# Altium project MAX51.PrjPCB
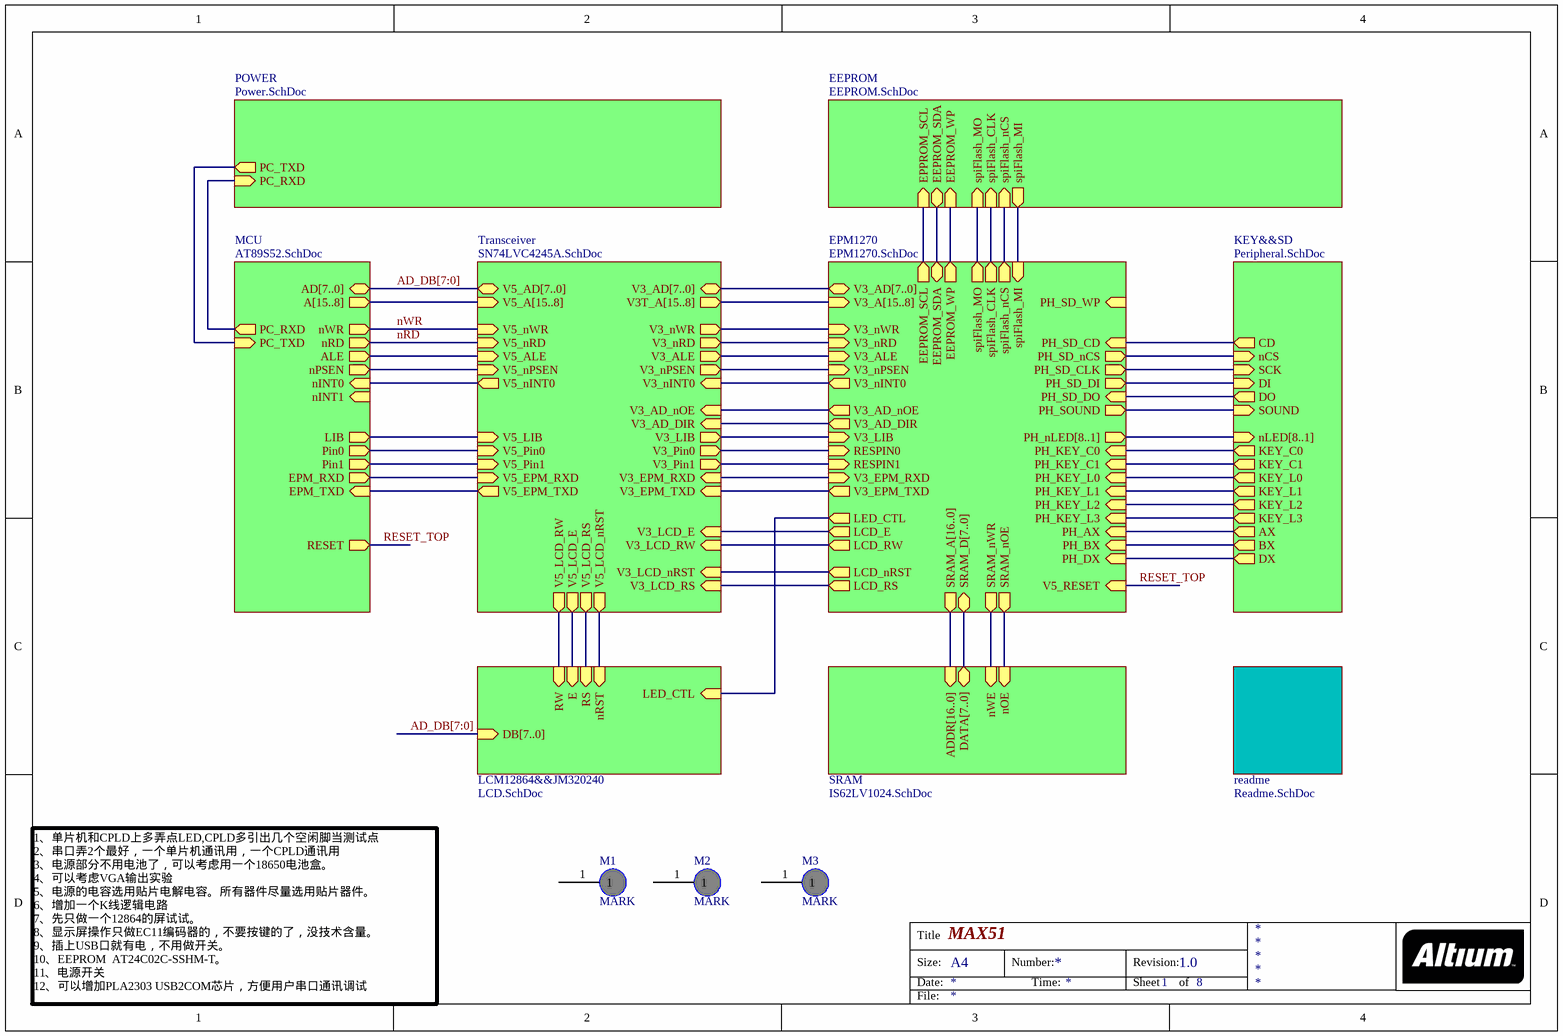
[diagram p0: Top.SchDoc]
8 sheets, 147 parts. Net scope: hierarchical (ports join the sheet entries above them; power ports are global).
Board file: MAX51.PcbDoc
Sheets:
  Top.SchDoc
    POWER = Power.SchDoc
    MCU = AT89S52.SchDoc
    EPM1270 = EPM1270.SchDoc
    KEY&&SD = Peripheral.SchDoc
    LCM12864&&JM320240 = LCD.SchDoc
    SRAM = IS62LV1024.SchDoc
    readme = Readme.SchDoc

## Sheet Top.SchDoc: MAX51
size A4; CompanyName: 北京一雄信息科技有限公司; DrawnBy: JIAWENWEI; Revision: 1.0; SheetNumber: 1; SheetTotal: 8

### Parts
M1  MARK  [MARK3MM]
M2  MARK  [MARK3MM]
M3  MARK  [MARK3MM]

### Sub-sheets
EEPROM = EEPROM.SchDoc (file not in this document): EEPROM_SDA (bidir), EPPROM_SCL (in), EEPROM_WP (in), spiFlash_MO (in), spiFlash_CLK (in), spiFlash_nCS (in), spiFlash_MI (out)
EPM1270 = EPM1270.SchDoc: V3_LIB (in), V3_nPSEN (in), V3_nRD (in), V3_nWR (in), V3_ALE (in), V3_nINT0 (out), SRAM_nOE (out), SRAM_nWR (out), LCD_RS (out), LCD_nRST (out), LED_CTL (out), V3_AD_nOE (out), V3_AD_DIR (out), PH_SD_CD (in), PH_SD_WP (in), PH_SD_nCS (out), PH_SD_CLK (out), PH_SD_DI (out), PH_SD_DO (in), PH_SOUND (out), PH_KEY_C0 (in), PH_KEY_C1 (in), PH_KEY_L0 (in), PH_KEY_L1 (in), PH_KEY_L2 (in), PH_AX (in), PH_BX (in), PH_DX (in), V3_AD[7..0] (bidir), SRAM_A[16..0] (out), SRAM_D[7..0] (bidir), V3_A[15..8] (in), PH_nLED[8..1] (out), LCD_E (out), LCD_RW (out), V3_EPM_TXD (out), V3_EPM_RXD (in), RESPIN0 (in), RESPIN1 (in), V5_RESET (in), EEPROM_SDA (bidir), EEPROM_SCL (out), EEPROM_WP (out), spiFlash_MO (out), spiFlash_MI (in), spiFlash_CLK (out), spiFlash_nCS (out), PH_KEY_L3 (in)
KEY&&SD = Peripheral.SchDoc: KEY_C0 (out), KEY_C1 (out), KEY_L0 (out), KEY_L1 (out), KEY_L2 (out), SOUND (in), DI (in), SCK (in), DO (out), CD (out), AX (out), BX (out), DX (out), nCS (in), nLED[8..1] (in), KEY_L3 (out)
LCM12864&&JM320240 = LCD.SchDoc: RS (in), LED_CTL (in), nRST (in), DB[7..0] (in), RW (in), E (in)
MCU = AT89S52.SchDoc: nWR (out), nRD (out), ALE (out), nPSEN (out), nINT0 (in), LIB (out), AD[7..0] (bidir), A[15..8] (out), EPM_TXD (in), EPM_RXD (out), Pin0 (out), Pin1 (out), PC_RXD (out), PC_TXD (in), nINT1 (in), RESET (out)
POWER = Power.SchDoc: PC_TXD (out), PC_RXD (in)
readme = Readme.SchDoc: no entries
SRAM = IS62LV1024.SchDoc: nWE (in), nOE (in), ADDR[16..0] (in), DATA[7..0] (bidir)
Transceiver = SN74LVC4245A.SchDoc (file not in this document): V3_LCD_RS (in), V3_LCD_nRST (in), V5_LCD_RS (out), V5_LCD_nRST (out), V3_AD_DIR (in), V3_AD_nOE (in), V3_nINT0 (in), V5_LIB (in), V5_nPSEN (in), V5_nRD (in), V5_nWR (in), V5_ALE (in), V3_LIB (out), V3_nPSEN (out), V3_nRD (out), V3_nWR (out), V3_ALE (out), V5_nINT0 (out), V5_AD[7..0] (bidir), V3_AD[7..0] (bidir), V5_A[15..8] (in), V3T_A[15..8] (out), V3_LCD_RW (in), V3_LCD_E (in), V5_LCD_RW (out), V5_LCD_E (out), V5_Pin0 (in), V3_Pin0 (out), V5_EPM_TXD (out), V3_EPM_TXD (in), V3_Pin1 (out), V5_Pin1 (in), V5_EPM_RXD (in), V3_EPM_RXD (in)

### Nets
~{CS}: sheet EPM1270/PH_SD_nCS, sheet KEY&&SD/nCS
ALE: sheet MCU/ALE, sheet Transceiver/V5_ALE
AX: sheet EPM1270/PH_AX, sheet KEY&&SD/AX
BX: sheet EPM1270/PH_BX, sheet KEY&&SD/BX
CD: sheet EPM1270/PH_SD_CD, sheet KEY&&SD/CD
DI: sheet EPM1270/PH_SD_DI, sheet KEY&&SD/DI
DO: sheet EPM1270/PH_SD_DO, sheet KEY&&SD/DO
DX: sheet EPM1270/PH_DX, sheet KEY&&SD/DX
E: sheet LCM12864&&JM320240/E, sheet Transceiver/V5_LCD_E
EPM_RXD: sheet MCU/EPM_RXD, sheet Transceiver/V5_EPM_RXD
EPM_TXD: sheet MCU/EPM_TXD, sheet Transceiver/V5_EPM_TXD
KEY_C0: sheet EPM1270/PH_KEY_C0, sheet KEY&&SD/KEY_C0
KEY_C1: sheet EPM1270/PH_KEY_C1, sheet KEY&&SD/KEY_C1
KEY_L0: sheet EPM1270/PH_KEY_L0, sheet KEY&&SD/KEY_L0
KEY_L1: sheet EPM1270/PH_KEY_L1, sheet KEY&&SD/KEY_L1
KEY_L2: sheet EPM1270/PH_KEY_L2, sheet KEY&&SD/KEY_L2
KEY_L3: sheet EPM1270/PH_KEY_L3, sheet KEY&&SD/KEY_L3
LCD_E: sheet EPM1270/LCD_E, sheet Transceiver/V3_LCD_E
LCD_nRST: sheet EPM1270/LCD_nRST, sheet Transceiver/V3_LCD_nRST
LCD_RS: sheet EPM1270/LCD_RS, sheet Transceiver/V3_LCD_RS
LCD_RW: sheet EPM1270/LCD_RW, sheet Transceiver/V3_LCD_RW
LED_CTL: sheet EPM1270/LED_CTL, sheet LCM12864&&JM320240/LED_CTL
LIB: sheet MCU/LIB, sheet Transceiver/V5_LIB
nINT0: sheet MCU/nINT0, sheet Transceiver/V5_nINT0
nOE: sheet EPM1270/SRAM_nOE, sheet SRAM/nOE
nPSEN: sheet MCU/nPSEN, sheet Transceiver/V5_nPSEN
nRD: sheet MCU/nRD, sheet Transceiver/V5_nRD
nRST: sheet LCM12864&&JM320240/nRST, sheet Transceiver/V5_LCD_nRST
nWE: sheet EPM1270/SRAM_nWR, sheet SRAM/nWE
nWR: sheet MCU/nWR, sheet Transceiver/V5_nWR
PC_RXD: sheet POWER/PC_RXD, sheet MCU/PC_RXD
PC_TXD: sheet POWER/PC_TXD, sheet MCU/PC_TXD
PH_SD_CLK: sheet EPM1270/PH_SD_CLK, sheet KEY&&SD/SCK
PH_SOUND: sheet EPM1270/PH_SOUND, sheet KEY&&SD/SOUND
Pin0: sheet MCU/Pin0, sheet Transceiver/V5_Pin0
Pin1: sheet MCU/Pin1, sheet Transceiver/V5_Pin1
RESET_TOP: sheet MCU/RESET, sheet EPM1270/V5_RESET  [project net RESET]
ResPin0: sheet EPM1270/RESPIN0, sheet Transceiver/V3_Pin0
ResPin1: sheet EPM1270/RESPIN1, sheet Transceiver/V3_Pin1
RS: sheet LCM12864&&JM320240/RS, sheet Transceiver/V5_LCD_RS
RW: sheet LCM12864&&JM320240/RW, sheet Transceiver/V5_LCD_RW
V3_ALE: sheet EPM1270/V3_ALE, sheet Transceiver/V3_ALE
V3_EPM_RXD: sheet EPM1270/V3_EPM_RXD, sheet Transceiver/V3_EPM_RXD
V3_EPM_TXD: sheet EPM1270/V3_EPM_TXD, sheet Transceiver/V3_EPM_TXD
V3_LIB: sheet EPM1270/V3_LIB, sheet Transceiver/V3_LIB
V3_nINT0: sheet EPM1270/V3_nINT0, sheet Transceiver/V3_nINT0
V3_nPSEN: sheet EPM1270/V3_nPSEN, sheet Transceiver/V3_nPSEN
V3_nRD: sheet EPM1270/V3_nRD, sheet Transceiver/V3_nRD
V3_nWR: sheet EPM1270/V3_nWR, sheet Transceiver/V3_nWR
NetU4_1: sheet EPM1270/V3_AD_DIR, sheet Transceiver/V3_AD_DIR
NetU4_2: sheet EPM1270/V3_AD_nOE, sheet Transceiver/V3_AD_nOE
NetU4_57: sheet EPM1270/EEPROM_SDA, sheet EEPROM/EEPROM_SDA
NetU4_58: sheet EPM1270/EEPROM_SCL, sheet EEPROM/EPPROM_SCL
NetU4_59: sheet EPM1270/EEPROM_WP, sheet EEPROM/EEPROM_WP
NetU4_66: sheet EPM1270/spiFlash_MO, sheet EEPROM/spiFlash_MO
NetU4_67: sheet EPM1270/spiFlash_CLK, sheet EEPROM/spiFlash_CLK
NetU4_68: sheet EPM1270/spiFlash_nCS, sheet EEPROM/spiFlash_nCS
NetU4_69: sheet EPM1270/spiFlash_MI, sheet EEPROM/spiFlash_MI

Not connected (* = marked no-connect by the designer): M1 1; M2 1; M3 1

### Buses and harness runs
bus AD_DB[7:0] = sheet LCM12864&&JM320240/DB[7..0]
bus AD_DB[7:0] = sheet MCU/AD[7..0] = sheet Transceiver/V5_AD[7..0]
bus sheet EPM1270/PH_nLED[8..1] = sheet KEY&&SD/nLED[8..1]
bus sheet EPM1270/SRAM_A[16..0] = sheet SRAM/ADDR[16..0]
bus sheet EPM1270/SRAM_D[7..0] = sheet SRAM/DATA[7..0]
bus sheet EPM1270/V3_A[15..8] = sheet Transceiver/V3T_A[15..8]
bus sheet EPM1270/V3_AD[7..0] = sheet Transceiver/V3_AD[7..0]
bus sheet MCU/A[15..8] = sheet Transceiver/V5_A[15..8]

### Notes on the sheet
- 1、单片机和CPLD上多弄点LED,CPLD多引出几个空闲脚当测试点
  2、串口弄2个最好，一个单片机通讯用，一个CPLD通讯用
  3、电源部分不用电池了，可以考虑用一个18650电池盒。
  4、可以考虑VGA输出实验
  5、电源的电容选用贴片电解电容。所有器件尽量选用贴片器件。
  6、增加一个K线逻辑电路
  7、先只做一个12864的屏试试。
  8、显示屏操作只做EC11编码器的，不要按键的了，没技术含量。
  9、插上USB口就有电，不用做开关。
  10、EEPROM  AT24C02C-SSHM-T。
  11、电源开关
  12、可以增加PLA2303 USB2COM芯片，方便用户串口通讯调试
- Title
- Size:
- Date:
- A4
- Number:
- Time:
- Revision:
- Sheet
- of
- File:

## Sheet Power.SchDoc
size A4; Organization: Altium Limited; Address1: L3, 12a Rodborough Rd; Address2: Frenchs Forest; Address3: NSW; Address4: Australia 2086; SheetNumber: 2; SheetTotal: 8
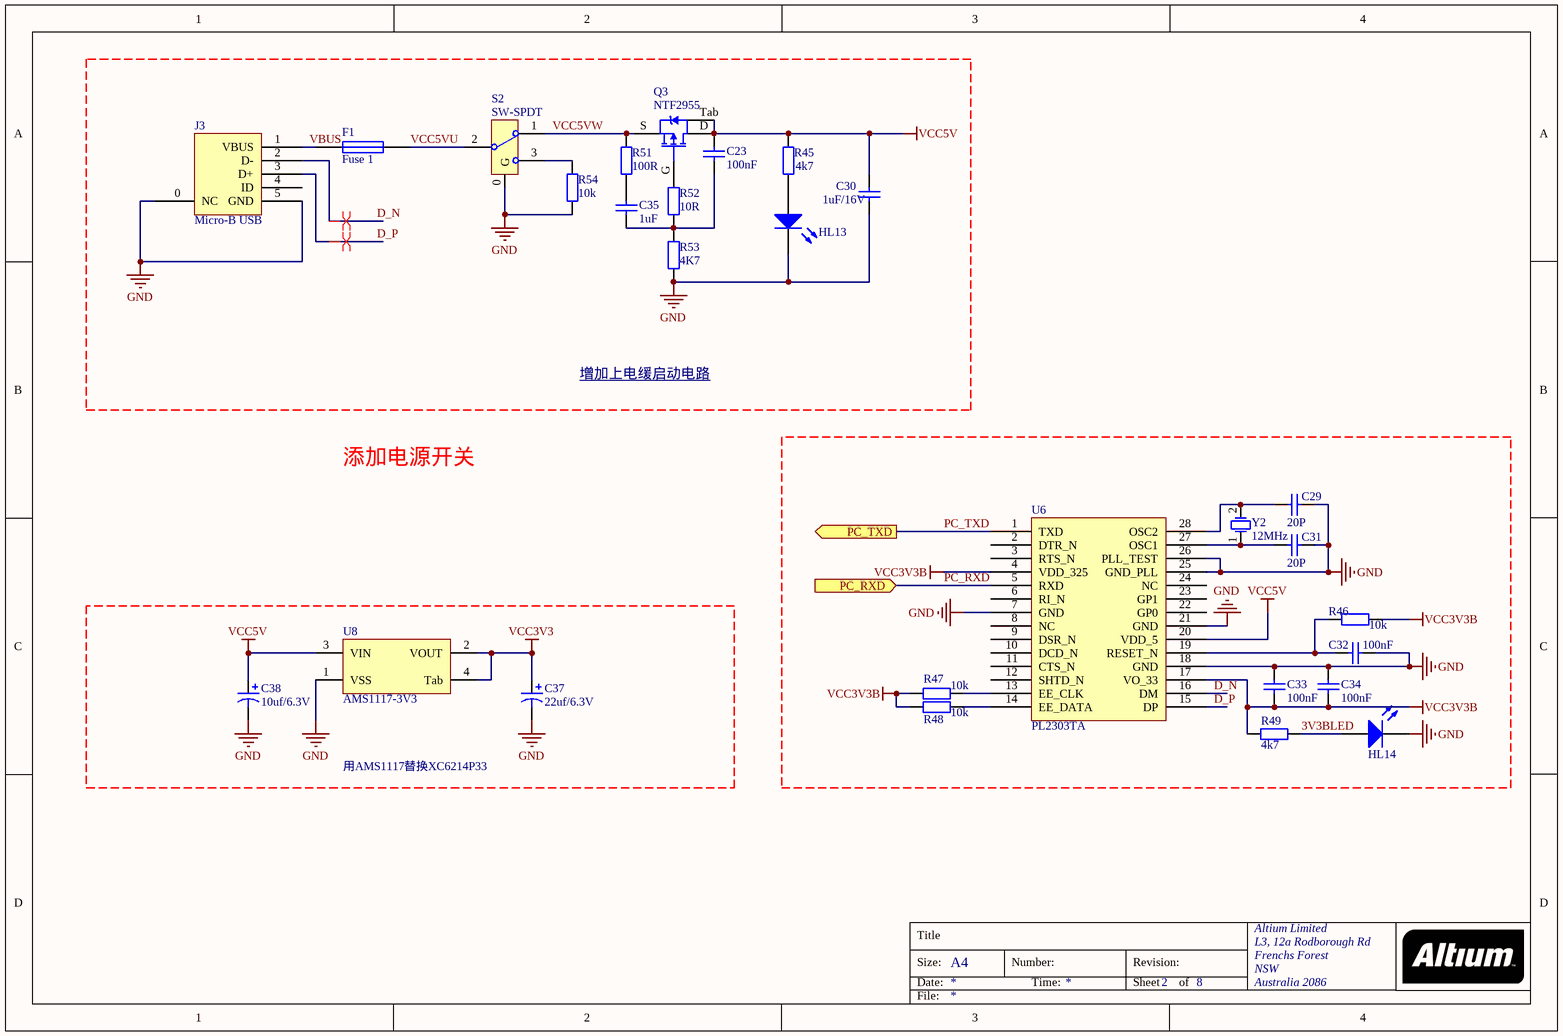
[diagram p1: Power.SchDoc]

### Parts
(Parts that share a designator on the sheet are numbered #1, #2 ... from top to bottom, then left to right.)
C23#1  100nF  [C0603]
C29  20P  [R0603]
C30  1uF/16V  [C0805]
C31  20P  [R0603]
C32  100nF  [R0603]
C33  100nF  [R0603]
C34  100nF  [C0805]
C35  1uF  [C0603]
C37  22uf/6.3V  [B-3528]
C38  10uf/6.3V  [B-3528]
F1  Fuse 1  [R0805]
HL13  LED  [LED_0603]  (value not drawn)
HL14  LED  [LED_0603]  (value not drawn)
J3  Micro-B USB  [Micro-B  USB1]
Q3  NTF2955  [NTF2955]
R45  4k7  [R0603]
R46  10k  [R0603]
R47  10k  [R0603]
R48  10k  [R0603]
R49  4k7  [R0603]
R51  100R  [R0603]
R52  10R  [R0603]
R53  4K7  [R0603]
R54  10k  [R0603]
S2  SW-SPDT  [SW_SPDT]
U6  PL2303TA  [SSOP28]
U8  AMS1117-3V3  [SOT-223]
Y2  12MHz  [XTAL]

### Ports
PC_RXD (in), PC_TXD (out)

### Nets
GND: C29.2 C30.1 C31.2 C32.1 C33.1 C34.1 C37.2 C38.2 HL13.K HL14.K J3.0(NC) J3.5(GND) R53.1 R54.1 S2.0(G) U6.7(GND) U6.18(GND) U6.21(GND) U6.25(GND_PLL) U6.26(PLL_TEST) U8.1(VSS)
VCC3V3: C37.1 U8.2(VOUT) U8.4(Tab)
VCC3V3B: C33.2 C34.2 R46.2 R47.1 R48.1 R49.1 U6.4(VDD_325) U6.17(VO_33)
VCC5V: C23#1.2 C30.2 C38.1 Q3.D Q3.Tab(D) R45.2 U6.20(VDD_5) U8.3(VIN)
3V3BLED: HL14.A R49.2
D_N: J3.2(D-) U6.16(DM)
D_P: J3.3(D+) U6.15(DP)
PC_RXD: U6.5(RXD) ; port PC_RXD
PC_TXD: U6.1(TXD) ; port PC_TXD
VBUS: F1.1 J3.1(VBUS)
VCC5VU: F1.2 S2.2(COMMON)
VCC5VW: Q3.S R51.2 S2.1(NO1)
NetC23#1_1: C23#1.1 C35.2 R52.1 R53.2
NetC29_1: C29.1 U6.28(OSC2) Y2.2(OSC2)
NetC31_1: C31.1 U6.27(OSC1) Y2.1(OSC1)
NetC32_2: C32.2 R46.1 U6.19(RESET_N)
NetC35_1: C35.1 R51.1
NetHL13_A: HL13.A R45.1
NetQ3_G: Q3.G R52.2
NetR47_2: R47.2 U6.13(EE_CLK)
NetR48_2: R48.2 U6.14(EE_DATA)
NetR54_2: R54.2 S2.3(NO3)

Not connected (* = marked no-connect by the designer): J3 4(ID); U6 2(DTR_N) 3(RTS_N) 6(RI_N) 8(NC) 9(DSR_N) 10(DCD_N) 11(CTS_N) 12(SHTD_N) 22(GP0) 23(GP1) 24(NC)

### Layout directives
differential pair: D_N, D_P

### Notes on the sheet
- 增加上电缓启动电路
- 添加电源开关
- 用AMS1117替换XC6214P33
- Title
- Size:
- Date:
- A4
- Number:
- Time:
- Revision:
- Sheet
- of
- File:

### Library data of the parts
C23#1 C30 C35 = CAP_08
C29 C31-C34 = CAP_06
C37 C38 = CAP_B
F1 = Fuse 1: Fuse; Published: 8-Jun-2000; LatestRevisionDate: 17-Jul-2002; LatestRevisionNote: Re-released for DXP Platform.; PackageReference: PIN-W2/E2.8; Publisher: Altium Limited; PackageDescription: Thru-Hole; 2 Leads
HL13 HL14 = LED 2
Q3 = NTF2955-3
R45-R49 R51-R54 = RES_06
S2 = SW-SPDT: Single-Pole, Duble Throw Switch; Published: 24-Mar-1999; LatestRevisionDate: 17-Jul-2002; LatestRevisionNote: Re-released for DXP Platform.; PackageReference: SPST-2; Publisher: Altium Limited; PackageDescription: Switch; 2 Leads
U8 = AMS1117
Y2 = XTAL: Passive crystal

## Sheet AT89S52.SchDoc
size A4; SheetNumber: 3; SheetTotal: 8
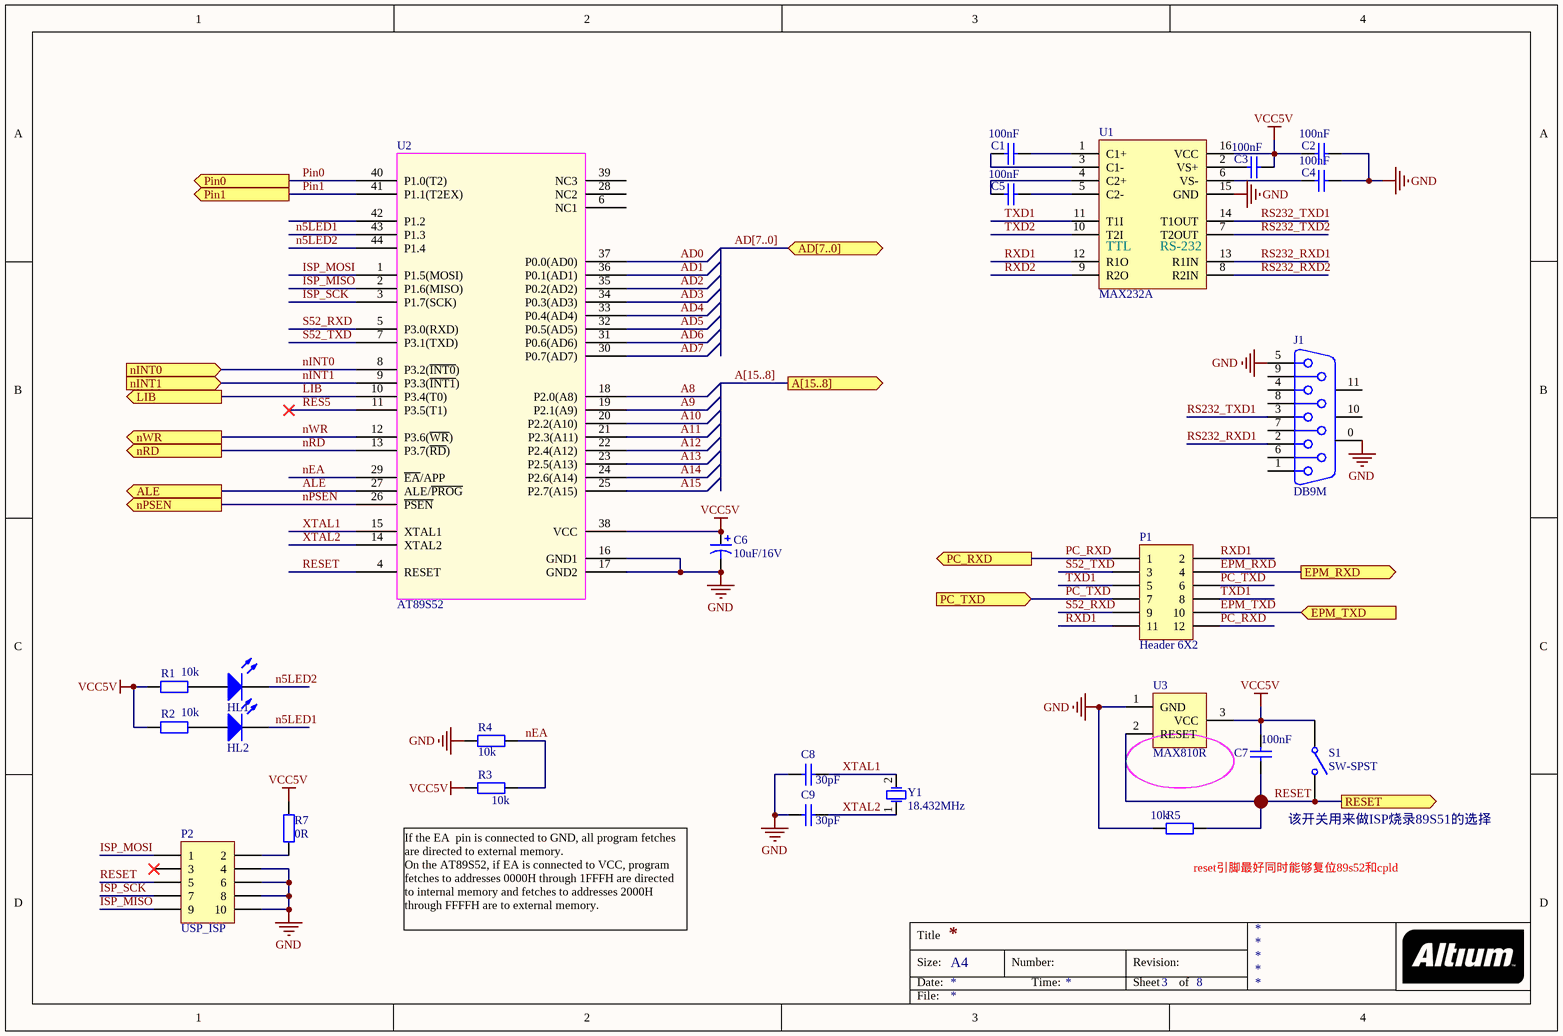
[diagram p2: AT89S52.SchDoc]

### Parts
(Parts that share a designator on the sheet are numbered #1, #2 ... from top to bottom, then left to right.)
C1  100nF  [R0603]
C2  100nF  [R0603]
C3  100nF  [R0603]
C4  100nF  [R0603]
C5  100nF  [R0603]
C6  10uF/16V  [C0805]
C7  100nF  [R0603]
C8  30pF  [R0603]
C9  30pF  [R0603]
HL1  LED  [LED_0603]  (value not drawn)
HL2  LED  [LED_0603]  (value not drawn)
J1  DB9M
P1  Header 6X2  [HDR2X6]
P2  USP_ISP  [HDR2X5]
R1  10k  [R0603]
R2  10k  [R0603]
R3  10k  [R0603]
R4  10k  [R0603]
R5  10k  [R0603]
R7#1  0R  [R0603]
S1  SW-SPST  [K1]
U1  MAX232A  [NSO16_M]
U2  AT89S52  [AT89S52-TQFP44]
U3  MAX810R  [MAX810R-SOT23]
Y1  18.432MHz  [XTAL]

### Ports
A[15..8] (out), AD[7..0] (bidir), ALE (out), EPM_RXD (out), EPM_TXD (in), LIB (out), nINT0 (in), nINT1 (in), nPSEN (out), nRD (out), nWR (out), PC_RXD (out), PC_TXD (in), Pin0 (out), Pin1 (out), RESET (out)

### Nets
GND: C2.1 C4.1 C6.2 C8.2 C9.2 J1.0 J1.5 P2.4 P2.6 P2.8 P2.10 R4.1 R5.1 U1.15(GND) U2.16(GND1) U2.17(GND2) U3.1(GND)
VCC5V: C2.2 C3.1 C6.1 C7.2 R1.2 R2.2 R3.2 R7#1.1 S1.1(COMMON) U1.16(VCC) U2.38(VCC) U3.3(VCC)
A8: U2.18(P2.0(A8))
A9: U2.19(P2.1(A9))
A10: U2.20(P2.2(A10))
A11: U2.21(P2.3(A11))
A12: U2.22(P2.4(A12))
A13: U2.23(P2.5(A13))
A14: U2.24(P2.6(A14))
A15: U2.25(P2.7(A15))
AD0: U2.37(P0.0(AD0))
AD1: U2.36(P0.1(AD1))
AD2: U2.35(P0.2(AD2))
AD3: U2.34(P0.3(AD3))
AD4: U2.33(P0.4(AD4))
AD5: U2.32(P0.5(AD5))
AD6: U2.31(P0.6(AD6))
AD7: U2.30(P0.7(AD7))
ALE: U2.27(ALE/~{PROG}) ; port ALE
EPM_RXD: P1.4 ; port EPM_RXD
EPM_TXD: P1.10 ; port EPM_TXD
ISP_MISO: P2.9 U2.2(P1.6(MISO))
ISP_MOSI: P2.1 U2.1(P1.5(MOSI))
ISP_SCK: P2.7 U2.3(P1.7(SCK))
LIB: U2.10(P3.4(T0)) ; port LIB
n5LED1: HL2.K U2.43(P1.3)
n5LED2: HL1.K U2.44(P1.4)
nEA: R3.1 R4.2 U2.29(~{EA}/APP)
nINT0: U2.8(P3.2(~{INT0})) ; port nINT0
nINT1: U2.9(P3.3(~{INT1})) ; port nINT1
nPSEN: U2.26(~{PSEN}) ; port nPSEN
nRD: U2.13(P3.7(~{RD})) ; port nRD
nWR: U2.12(P3.6(~{WR})) ; port nWR
PC_RXD: P1.1 P1.12 ; port PC_RXD
PC_TXD: P1.6 P1.7 ; port PC_TXD
Pin0: U2.40(P1.0(T2)) ; port Pin0
Pin1: U2.41(P1.1(T2EX)) ; port Pin1
RES5: U2.11(P3.5(T1))
RESET: C7.1 P2.5 R5.2 S1.2(NO) U2.4(RESET) U3.2(RESET) ; port RESET
RS232_RXD1: J1.2 U1.13(R1IN)
RS232_RXD2: U1.8(R2IN)
RS232_TXD1: J1.3 U1.14(T1OUT)
RS232_TXD2: U1.7(T2OUT)
RXD1: P1.2 P1.11 U1.12(R1O)
RXD2: U1.9(R2O)
S52_RXD: P1.9 U2.5(P3.0(RXD))
S52_TXD: P1.3 U2.7(P3.1(TXD))
TXD1: P1.5 P1.8 U1.11(T1I)
TXD2: U1.10(T2I)
XTAL1: C8.1 U2.15(XTAL1) Y1.2(OSC2)
XTAL2: C9.1 U2.14(XTAL2) Y1.1(OSC1)
NetC1_1: C1.1 U1.1(C1+)
NetC1_2: C1.2 U1.3(C1-)
NetC3_2: C3.2 U1.2(VS+)
NetC4_2: C4.2 U1.6(VS-)
NetC5_1: C5.1 U1.5(C2-)
NetC5_2: C5.2 U1.4(C2+)
NetHL1_A: HL1.A R1.1
NetHL2_A: HL2.A R2.1
NetP2_2: P2.2 R7#1.2

Not connected (* = marked no-connect by the designer): J1 1 4 6 7 8 9 10(MH1) 11(MH2); P2 3*; U2 6(NC1) 28(NC2) 39(NC3) 42(P1.2)

### Buses and harness runs
bus A[15..8] = port A[15..8]
bus AD[7..0] = port AD[7..0]

### Notes on the sheet
- 该开关用来做ISP烧录89S51的选择
- (near R3) If the EA  pin is connected to GND, all program fetches
  are directed to external memory.
  On the AT89S52, if EA is connected to VCC, program
  fetches to addresses 0000H through 1FFFH are directed
  to internal memory and fetches to addresses 2000H
  through FFFFH are to external memory.
- (near R5) reset引脚最好同时能够复位89s52和cpld
- Title
- Size:
- Date:
- A4
- Number:
- Time:
- Revision:
- Sheet
- of
- File:
- (in symbol MAX232A) TTL; RS-232

### Library data of the parts
C1-C5 C7 = CAP_04: Value: 100nF
C6 = CAP_A
C8 C9 = CAP_04: Value: 100nF
HL1 HL2 = LED 2
P1 = Header 6X2: Header, 6-Pin, Dual row; LatestRevisionDate: 17-Jul-2002; LatestRevisionNote: Re-released for DXP Platform.; Publisher: Altium Limited
P2 = Header 5X2: Header, 5-Pin, Dual row; LatestRevisionDate: 17-Jul-2002; LatestRevisionNote: Re-released for DXP Platform.; Publisher: Altium Limited
R1 R2 = RES_04: Value: 10K
R3 = RES_04: 0402R; Value: 10K
R4 R5 = RES_04: 0402; Value: 10K
R7#1 = RES_04: 0402R; Value: 10K
S1 = SW-SPST: Single-Pole, Single-Throw Switch; Published: 24-Mar-1999; LatestRevisionDate: 17-Jul-2002; LatestRevisionNote: Re-released for DXP Platform.; PackageReference: SPST-2; Publisher: Altium Limited; PackageDescription: Switch; 2 Leads
U1 = MAX232A: +5V-Powered, Multichannel RS-232 Drivers/Receivers
U2 = AT89S52-24U
Y1 = XTAL: Passive crystal

## Sheet EPM1270.SchDoc
size A4; Organization: Altium Limited; Address1: L3, 12a Rodborough Rd; Address2: Frenchs Forest; Address3: NSW; Address4: Australia 2086; SheetNumber: 4; SheetTotal: 8
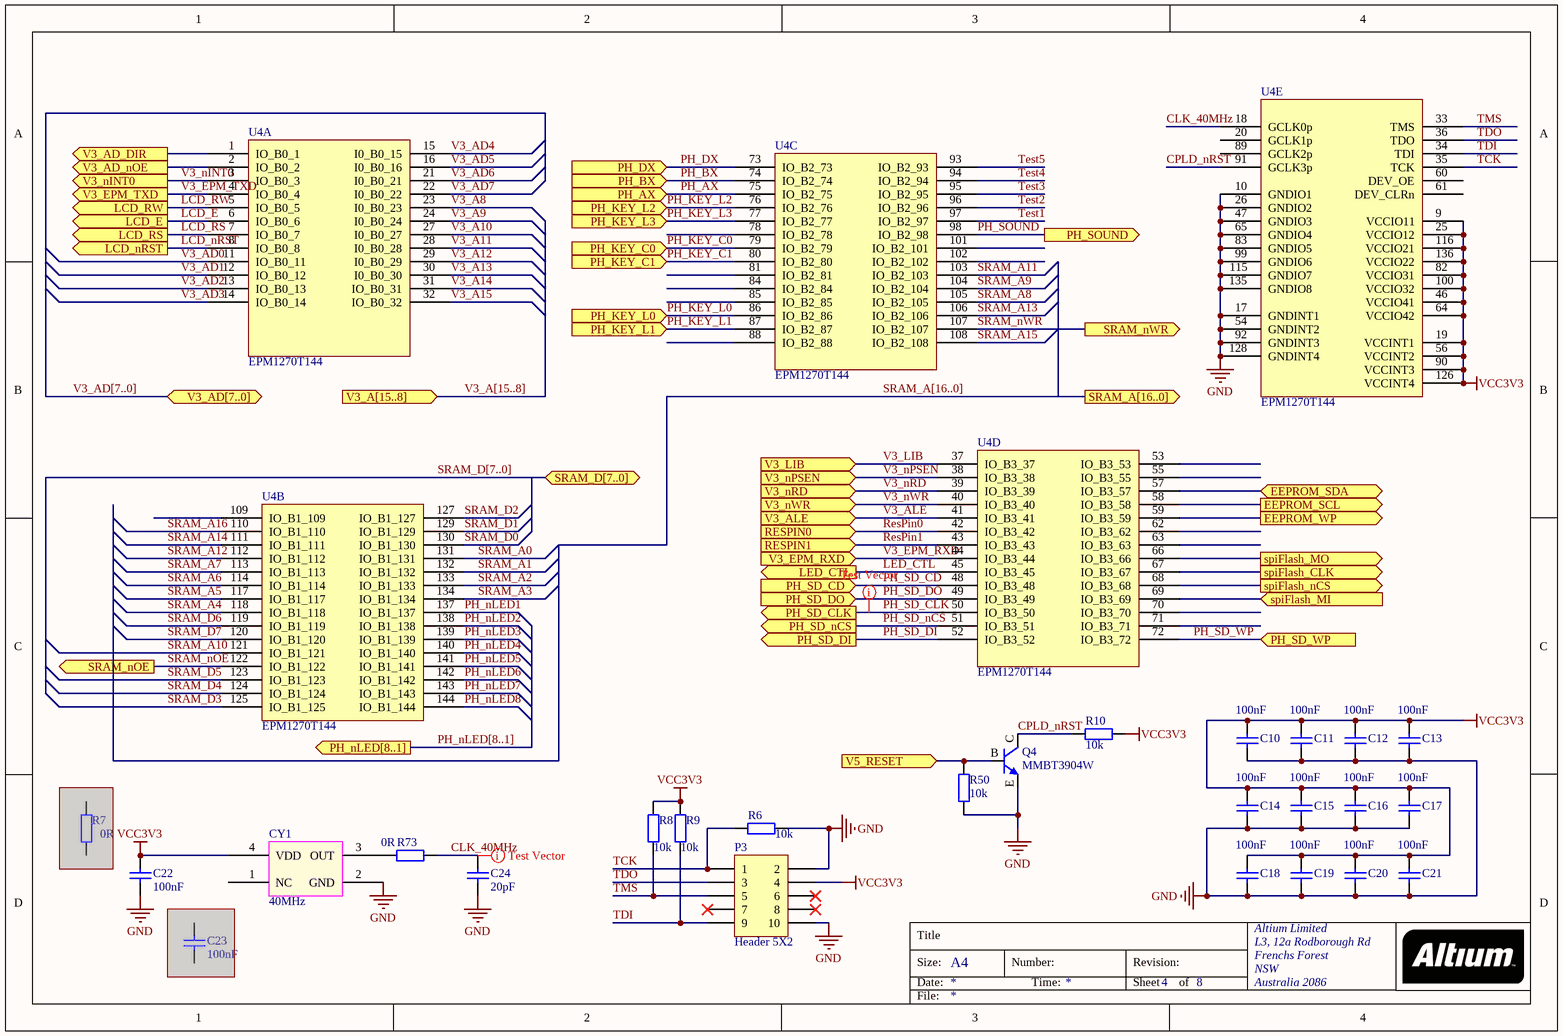
[diagram p3: EPM1270.SchDoc]

### Parts
(Parts that share a designator on the sheet are numbered #1, #2 ... from top to bottom, then left to right.)
C10  100nF  [R0603]
C11  100nF  [R0603]
C12  100nF  [R0603]
C13  100nF  [R0603]
C14  100nF  [R0603]
C15  100nF  [R0603]
C16  100nF  [R0603]
C17  100nF  [R0603]
C18  100nF  [R0603]
C19  100nF  [R0603]
C20  100nF  [R0603]
C21  100nF  [R0603]
C22  100nF  [R0603]
C23#2  100nF  [R0603]  (masked out: inside a compile mask, not in the netlist)
C24  value 20pF  [R0603]  (hidden comment: 100nF)
CY1  40MHz  [XCY4_5032]
P3  Header 5X2  [HDR2X5]
Q4  MMBT3904W  [SOT_23]
R6  10k  [R0603]
R7#2  0R  [R0603]  (masked out: inside a compile mask, not in the netlist)
R8  10k  [R0603]
R9  10k  [R0603]
R10  10k  [R0603]
R50  10k  [R0603]
R73  0R  [R0603]
U4  EPM1270T144  [EPM1270T144-TQFP]  (parts A,B,C,D,E of 5)

### Ports
EEPROM_SCL (out), EEPROM_SDA (bidir), EEPROM_WP (out), LCD_E (out), LCD_nRST (out), LCD_RS (out), LCD_RW (out), LED_CTL (out), PH_AX (in), PH_BX (in), PH_DX (in), PH_KEY_C0 (in), PH_KEY_C1 (in), PH_KEY_L0 (in), PH_KEY_L1 (in), PH_KEY_L2 (in), PH_KEY_L3 (in), PH_nLED[8..1] (out), PH_SD_CD (in), PH_SD_CLK (out), PH_SD_DI (out), PH_SD_DO (in), PH_SD_nCS (out), PH_SD_WP (in), PH_SOUND (out), RESPIN0 (in), RESPIN1 (in), spiFlash_CLK (out), spiFlash_MI (in), spiFlash_MO (out), spiFlash_nCS (out), SRAM_A[16..0] (out), SRAM_D[7..0] (bidir), SRAM_nOE (out), SRAM_nWR (out), V3_A[15..8] (in), V3_AD[7..0] (bidir), V3_AD_DIR (out), V3_AD_nOE (out), V3_ALE (in), V3_EPM_RXD (in), V3_EPM_TXD (out), V3_LIB (in), V3_nINT0 (out), V3_nPSEN (in), V3_nRD (in), V3_nWR (in), V5_RESET (in)

### Nets
GND: C10.2 C11.2 C12.2 C13.2 C14.2 C15.2 C16.2 C17.2 C18.2 C19.2 C20.2 C21.2 C22.2 C24.2 CY1.2(GND) P3.2 P3.10 Q4.E R6.1 R50.2 U4.10(GNDIO1) U4.17(GNDINT1) U4.26(GNDIO2) U4.47(GNDIO3) U4.54(GNDINT2) U4.65(GNDIO4) U4.83(GNDIO5) U4.92(GNDINT3) U4.99(GNDIO6) U4.115(GNDIO7) U4.128(GNDINT4) U4.135(GNDIO8)
VCC3V3: C10.1 C11.1 C12.1 C13.1 C14.1 C15.1 C16.1 C17.1 C18.1 C19.1 C20.1 C21.1 C22.1 CY1.4(VDD) P3.4 R8.2 R9.2 R10.2 U4.9(VCCIO11) U4.19(VCCINT1) U4.25(VCCIO12) U4.46(VCCIO41) U4.56(VCCINT2) U4.64(VCCIO42) U4.82(VCCIO31) U4.90(VCCINT3) U4.100(VCCIO32) U4.116(VCCIO21) U4.126(VCCINT4) U4.136(VCCIO22)
CLK_40MHz: C24.1 R73.2 U4.18(GCLK0p)
CPLD_nRST: Q4.C R10.1 U4.91(GCLK3p)
LCD_E: U4.6(IO_B0_6) ; port LCD_E
LCD_nRST: U4.8(IO_B0_8) ; port LCD_nRST
LCD_RS: U4.7(IO_B0_7) ; port LCD_RS
LCD_RW: U4.5(IO_B0_5) ; port LCD_RW
LED_CTL: U4.45(IO_B3_45) ; port LED_CTL
PH_AX: U4.75(IO_B2_75) ; port PH_AX  [project net AX]
PH_BX: U4.74(IO_B2_74) ; port PH_BX  [project net BX]
PH_DX: U4.73(IO_B2_73) ; port PH_DX  [project net DX]
PH_KEY_C0: U4.79(IO_B2_79) ; port PH_KEY_C0  [project net KEY_C0]
PH_KEY_C1: U4.80(IO_B2_80) ; port PH_KEY_C1  [project net KEY_C1]
PH_KEY_L0: U4.86(IO_B2_86) ; port PH_KEY_L0  [project net KEY_L0]
PH_KEY_L1: U4.87(IO_B2_87) ; port PH_KEY_L1  [project net KEY_L1]
PH_KEY_L2: U4.76(IO_B2_76) ; port PH_KEY_L2  [project net KEY_L2]
PH_KEY_L3: U4.77(IO_B2_77) ; port PH_KEY_L3  [project net KEY_L3]
PH_nLED1: U4.137(IO_B1_137)  [project net nLED1]
PH_nLED2: U4.138(IO_B1_138)  [project net nLED2]
PH_nLED3: U4.139(IO_B1_139)  [project net nLED3]
PH_nLED4: U4.140(IO_B1_140)  [project net nLED4]
PH_nLED5: U4.141(IO_B1_141)  [project net nLED5]
PH_nLED6: U4.142(IO_B1_142)  [project net nLED6]
PH_nLED7: U4.143(IO_B1_143)  [project net nLED7]
PH_nLED8: U4.144(IO_B1_144)  [project net nLED8]
PH_SD_CD: U4.48(IO_B3_48) ; port PH_SD_CD  [project net CD]
PH_SD_CLK: U4.50(IO_B3_50) ; port PH_SD_CLK
PH_SD_DI: U4.52(IO_B3_52) ; port PH_SD_DI  [project net DI]
PH_SD_DO: U4.49(IO_B3_49) ; port PH_SD_DO  [project net DO]
PH_SD_nCS: U4.51(IO_B3_51) ; port PH_SD_nCS  [project net ~{CS}]
PH_SD_WP: U4.72(IO_B3_72) ; port PH_SD_WP
PH_SOUND: U4.98(IO_B2_98) ; port PH_SOUND
RESET: Q4.B R50.1 ; port V5_RESET
ResPin0: U4.42(IO_B3_42) ; port RESPIN0
ResPin1: U4.43(IO_B3_43) ; port RESPIN1
SRAM_A0: U4.131(IO_B1_131)  [project net ADDR0]
SRAM_A1: U4.132(IO_B1_132)  [project net ADDR1]
SRAM_A2: U4.133(IO_B1_133)  [project net ADDR2]
SRAM_A3: U4.134(IO_B1_134)  [project net ADDR3]
SRAM_A4: U4.118(IO_B1_118)  [project net ADDR4]
SRAM_A5: U4.117(IO_B1_117)  [project net ADDR5]
SRAM_A6: U4.114(IO_B1_114)  [project net ADDR6]
SRAM_A7: U4.113(IO_B1_113)  [project net ADDR7]
SRAM_A8: U4.105(IO_B2_105)  [project net ADDR8]
SRAM_A9: U4.104(IO_B2_104)  [project net ADDR9]
SRAM_A10: U4.121(IO_B1_121)  [project net ADDR10]
SRAM_A11: U4.103(IO_B2_103)  [project net ADDR11]
SRAM_A12: U4.112(IO_B1_112)  [project net ADDR12]
SRAM_A13: U4.106(IO_B2_106)  [project net ADDR13]
SRAM_A14: U4.111(IO_B1_111)  [project net ADDR14]
SRAM_A15: U4.108(IO_B2_108)  [project net ADDR15]
SRAM_A16: U4.110(IO_B1_110)  [project net ADDR16]
SRAM_D0: U4.130(IO_B1_130)  [project net DATA0]
SRAM_D1: U4.129(IO_B1_129)  [project net DATA1]
SRAM_D2: U4.127(IO_B1_127)  [project net DATA2]
SRAM_D3: U4.125(IO_B1_125)  [project net DATA3]
SRAM_D4: U4.124(IO_B1_124)  [project net DATA4]
SRAM_D5: U4.123(IO_B1_123)  [project net DATA5]
SRAM_D6: U4.119(IO_B1_119)  [project net DATA6]
SRAM_D7: U4.120(IO_B1_120)  [project net DATA7]
SRAM_nOE: U4.122(IO_B1_122) ; port SRAM_nOE  [project net nOE]
SRAM_nWR: U4.107(IO_B2_107) ; port SRAM_nWR  [project net nWE]
TCK: P3.1 R6.2 U4.35(TCK)
TDI: P3.9 R9.1 U4.34(TDI)
TDO: P3.3 U4.36(TDO)
Test1: U4.97(IO_B2_97)
Test2: U4.96(IO_B2_96)
Test3: U4.95(IO_B2_95)
Test4: U4.94(IO_B2_94)
Test5: U4.93(IO_B2_93)
TMS: P3.5 R8.1 U4.33(TMS)
V3_A8: U4.23(I0_B0_23)
V3_A9: U4.24(I0_B0_24)
V3_A10: U4.27(I0_B0_27)
V3_A11: U4.28(I0_B0_28)
V3_A12: U4.29(I0_B0_29)
V3_A13: U4.30(I0_B0_30)
V3_A14: U4.31(IO_B0_31)
V3_A15: U4.32(IO_B0_32)
V3_AD0: U4.11(IO_B0_11)
V3_AD1: U4.12(IO_B0_12)
V3_AD2: U4.13(IO_B0_13)
V3_AD3: U4.14(IO_B0_14)
V3_AD4: U4.15(I0_B0_15)
V3_AD5: U4.16(I0_B0_16)
V3_AD6: U4.21(I0_B0_21)
V3_AD7: U4.22(I0_B0_22)
V3_ALE: U4.41(IO_B3_41) ; port V3_ALE
V3_EPM_RXD: U4.44(IO_B3_44) ; port V3_EPM_RXD
V3_EPM_TXD: U4.4(IO_B0_4) ; port V3_EPM_TXD
V3_LIB: U4.37(IO_B3_37) ; port V3_LIB
V3_nINT0: U4.3(IO_B0_3) ; port V3_nINT0
V3_nPSEN: U4.38(IO_B3_38) ; port V3_nPSEN
V3_nRD: U4.39(IO_B3_39) ; port V3_nRD
V3_nWR: U4.40(IO_B3_40) ; port V3_nWR
NetCY1_3: CY1.3(OUT) R73.1
NetU4_1: U4.1(IO_B0_1) ; port V3_AD_DIR
NetU4_2: U4.2(IO_B0_2) ; port V3_AD_nOE
NetU4_57: U4.57(IO_B3_57) ; port EEPROM_SDA
NetU4_58: U4.58(IO_B3_58) ; port EEPROM_SCL
NetU4_59: U4.59(IO_B3_59) ; port EEPROM_WP
NetU4_66: U4.66(IO_B3_66) ; port spiFlash_MO
NetU4_67: U4.67(IO_B3_67) ; port spiFlash_CLK
NetU4_68: U4.68(IO_B3_68) ; port spiFlash_nCS
NetU4_69: U4.69(IO_B3_69) ; port spiFlash_MI

Not connected (* = marked no-connect by the designer): CY1 1(NC); P3 6* 7* 8*; U4 20(GCLK1p) 53(IO_B3_53) 55(IO_B3_55) 60(DEV_OE) 61(DEV_CLRn) 62(IO_B3_62) 63(IO_B3_63) 70(IO_B3_70) 71(IO_B3_71) 78(IO_B2_78) 81(IO_B2_81) 84(IO_B2_84) 85(IO_B2_85) 88(IO_B2_88) 89(GCLK2p) 101(IO_B2_101) 102(IO_B2_102) 109(IO_B1_109)

### Buses and harness runs
bus PH_nLED[8..1] = port PH_nLED[8..1]
bus SRAM_A[16..0] = port SRAM_A[16..0]
bus SRAM_D[7..0] = port SRAM_D[7..0]
bus V3_A[15..8] = port V3_A[15..8]
bus V3_AD[7..0] = port V3_AD[7..0]

### Layout directives
Column: TestVectorIndex: CLK_40MHz, PH_SD_CLK

### Notes on the sheet
- Title
- Size:
- Date:
- A4
- Number:
- Time:
- Revision:
- Sheet
- of
- File:

### Library data of the parts
C10-C22 C23#2 C24 = CAP_04
  C10-C22 C23#2: Value: 100nF
CY1 = XTAL_4P: Active crystal
P3 = Header 5X2: Header, 5-Pin, Dual row; LatestRevisionDate: 17-Jul-2002; LatestRevisionNote: Re-released for DXP Platform.; Publisher: Altium Limited
Q4 = MMBT3904TT1G
R6 R7#2 R8-R10 R50 R73 = RES_04: 0402
  R6 R8-R10 R50: Value: 10K
  R7#2 R73: Value: 0R

## Sheet Peripheral.SchDoc
size A4; Organization: Altium Limited; Address1: L3, 12a Rodborough Rd; Address2: Frenchs Forest; Address3: NSW; Address4: Australia 2086
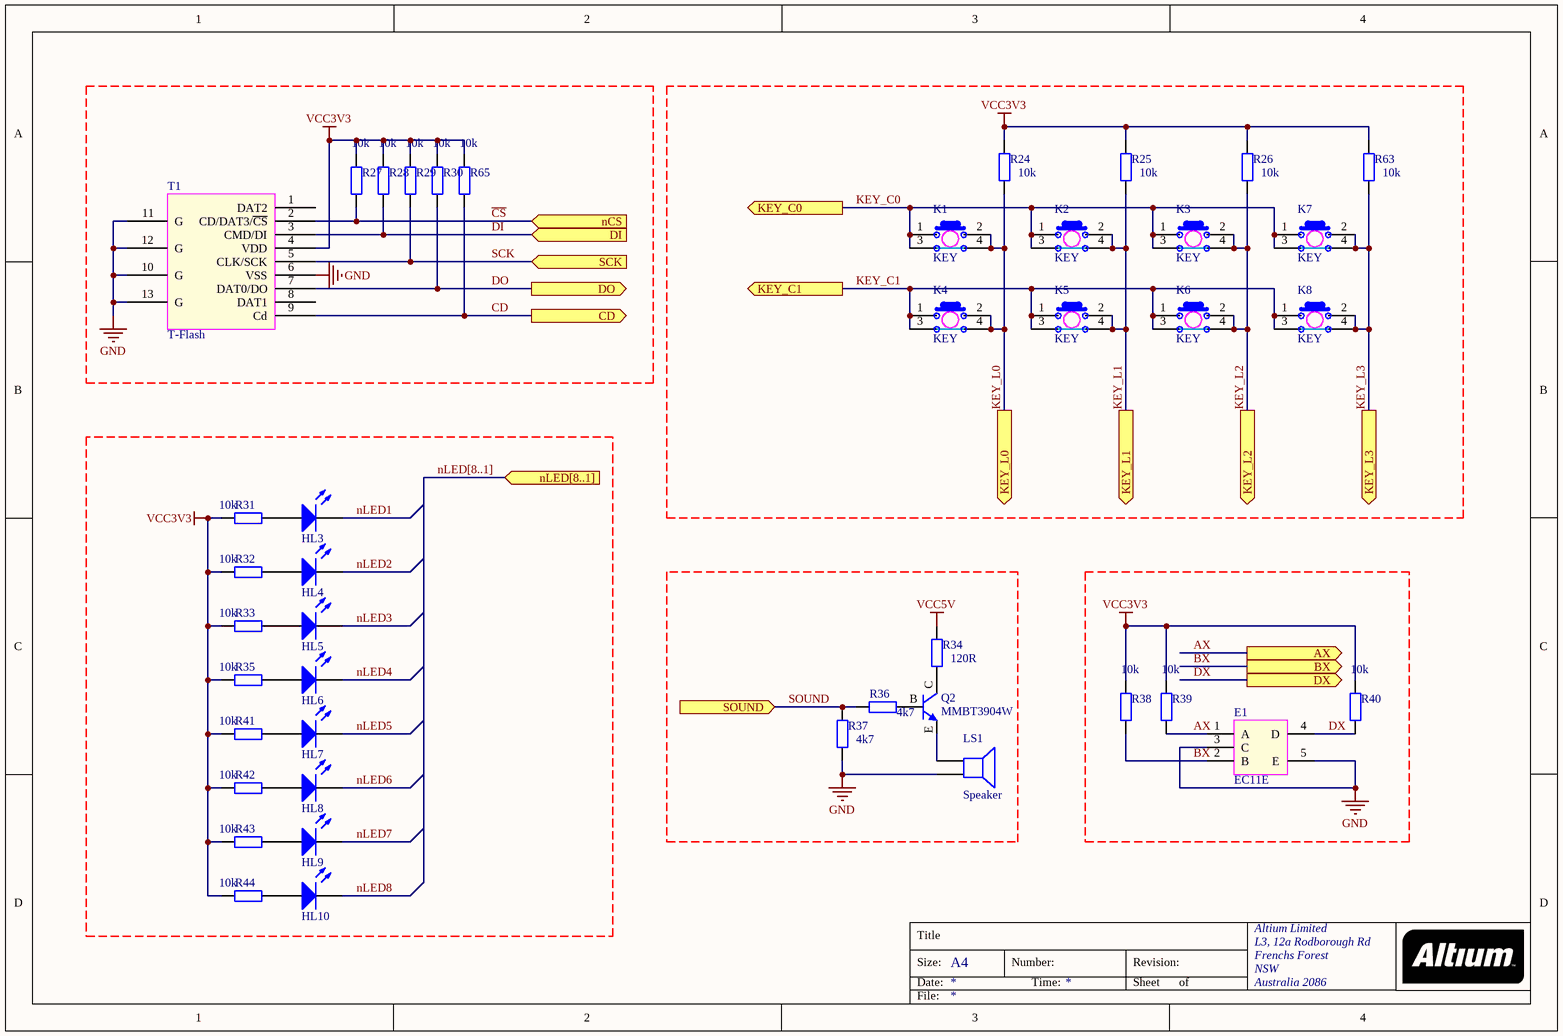
[diagram p4: Peripheral.SchDoc]

### Parts
E1  EC11E  [EC11E]
HL3  LED  [LED_0603]  (value not drawn)
HL4  LED  [LED_0603]  (value not drawn)
HL5  LED  [LED_0603]  (value not drawn)
HL6  LED  [LED_0603]  (value not drawn)
HL7  LED  [LED_0603]  (value not drawn)
HL8  LED  [LED_0603]  (value not drawn)
HL9  LED  [LED_0603]  (value not drawn)
HL10  LED  [LED_0603]  (value not drawn)
K1  KEY
K2  KEY
K3  KEY
K4  KEY
K5  KEY
K6  KEY
K7  KEY  [KEY3]
K8  KEY  [KEY3]
LS1  Speaker  [SPK1]
Q2  MMBT3904W  [SOT_23]
R24  10k  [R0603]
R25  10k  [R0603]
R26  10k  [R0603]
R27  10k  [R0603]
R28  10k  [R0603]
R29  10k  [R0603]
R30  10k  [R0603]
R31  10k  [R0603]
R32  10k  [R0603]
R33  10k  [R0603]
R34  120R  [R0603]
R35  10k  [R0603]
R36  4k7  [R0603]
R37  4k7  [R0603]
R38  10k  [R0603]
R39  10k  [R0603]
R40  10k  [R0603]
R41  10k  [R0603]
R42  10k  [R0603]
R43  10k  [R0603]
R44  10k  [R0603]
R63  10k  [R0603]
R65  10k  [R0603]
T1  T-Flash  [Micro-SD]

### Ports
AX (out), BX (out), CD (out), DI (in), DO (out), DX (out), KEY_C0 (out), KEY_C1 (out), KEY_L0 (out), KEY_L1 (out), KEY_L2 (out), KEY_L3 (out), nCS (in), nLED[8..1] (in), SCK (in), SOUND (in)

### Nets
GND: E1.3(C) E1.5(E) LS1.2 R37.2 T1.6(VSS) T1.10(G) T1.11(G) T1.12(G) T1.13(G)
VCC3V3: R24.2 R25.2 R26.2 R27.2 R28.2 R29.2 R30.2 R31.2 R32.2 R33.2 R35.2 R38.2 R39.2 R40.2 R41.2 R42.2 R43.2 R44.2 R63.2 R65.2 T1.4(VDD)
VCC5V: R34.1
~{CS}: R27.1 T1.2(CD/DAT3/~{CS}) ; port nCS
AX: E1.1(A) R39.1 ; port AX
BX: E1.2(B) R38.1 ; port BX
CD: R65.1 T1.9(Cd) ; port CD
DI: R28.1 T1.3(CMD/DI) ; port DI
DO: R30.1 T1.7(DAT0/DO) ; port DO
DX: E1.4(D) R40.1 ; port DX
KEY_C0: K1.1 K1.3 K2.1 K2.3 K3.1 K3.3 K7.1 K7.3 ; port KEY_C0
KEY_C1: K4.1 K4.3 K5.1 K5.3 K6.1 K6.3 K8.1 K8.3 ; port KEY_C1
KEY_L0: K1.2 K1.4 K4.2 K4.4 R24.1 ; port KEY_L0
KEY_L1: K2.2 K2.4 K5.2 K5.4 R25.1 ; port KEY_L1
KEY_L2: K3.2 K3.4 K6.2 K6.4 R26.1 ; port KEY_L2
KEY_L3: K7.2 K7.4 K8.2 K8.4 R63.1 ; port KEY_L3
nLED1: HL3.K
nLED2: HL4.K
nLED3: HL5.K
nLED4: HL6.K
nLED5: HL7.K
nLED6: HL8.K
nLED7: HL9.K
nLED8: HL10.K
SCK: R29.1 T1.5(CLK/SCK) ; port SCK  [project net PH_SD_CLK]
SOUND: R36.2 R37.1 ; port SOUND  [project net PH_SOUND]
NetHL3_A: HL3.A R31.1
NetHL4_A: HL4.A R32.1
NetHL5_A: HL5.A R33.1
NetHL6_A: HL6.A R35.1
NetHL7_A: HL7.A R41.1
NetHL8_A: HL8.A R42.1
NetHL9_A: HL9.A R43.1
NetHL10_A: HL10.A R44.1
NetLS1_1: LS1.1 Q2.E
NetQ2_B: Q2.B R36.1
NetQ2_C: Q2.C R34.2

Not connected (* = marked no-connect by the designer): T1 1(DAT2) 8(DAT1)

### Buses and harness runs
bus nLED[8..1] = port nLED[8..1]

### Notes on the sheet
- Title
- Size:
- Date:
- A4
- Number:
- Time:
- Revision:
- Sheet
- of
- File:

### Library data of the parts
E1 = EC11E: encoder
HL3-HL10 = LED 2
LS1 = Speaker: Loudspeaker; Published: 24-Mar-1999; LatestRevisionDate: 17-Jul-2002; LatestRevisionNote: Re-released for DXP Platform.; PackageReference: PIN2; Publisher: Altium Limited
Q2 = MMBT3904TT1G
R24-R33 R35 R38-R44 R63 R65 = RES_04: Value: 10K
R34 R36 R37 = RES_04: Value: 10K
T1 = T-Flash: MICRO SD

## Sheet LCD.SchDoc
size A4; Organization: Altium Limited; Address1: L3, 12a Rodborough Rd; Address2: Frenchs Forest; Address3: NSW; Address4: Australia 2086
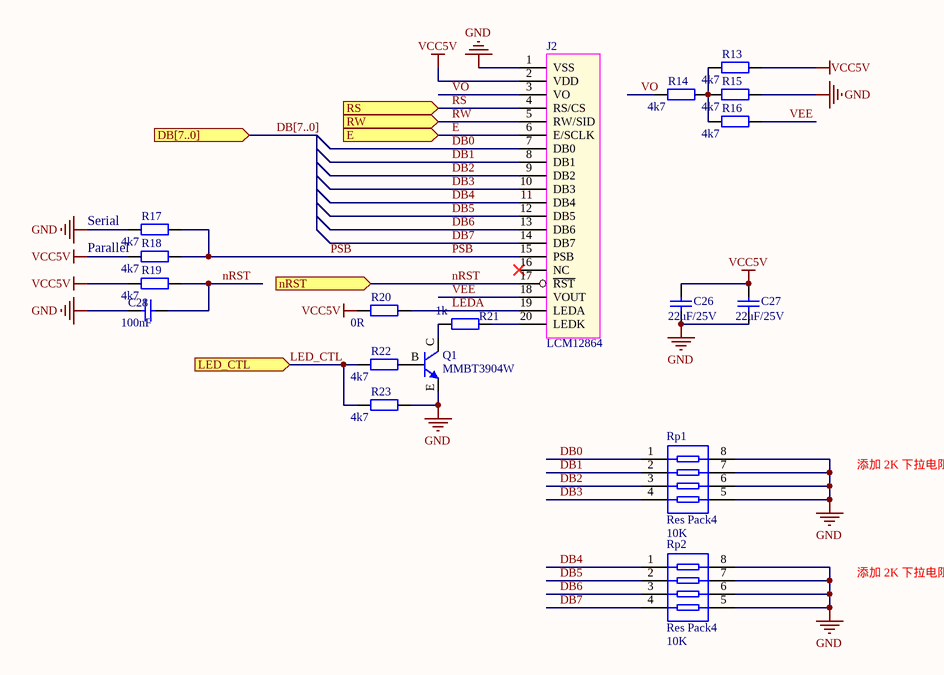
[diagram p5: LCD.SchDoc]

### Parts
C26  22uF/25V  [C0805]
C27  22uF/25V  [C0805]
C28  100nF  [R0603]
J2  LCM12864  [LCD12864]
Q1  MMBT3904W  [SOT_23]
R13  4k7  [R0603]
R14  4k7  [R0603]
R15  4k7  [R0603]
R16  4k7  [R0603]
R17  4k7  [R0603]
R18  4k7  [R0603]
R19  4k7  [R0603]
R20  0R  [R0603]
R21  1k  [R0603]
R22  4k7  [R0603]
R23  4k7  [R0603]
Rp1  Res Pack4  value 10K  [0603X4]
Rp2  Res Pack4  value 10K  [0603X4]

### Ports
DB[7..0] (in), E (in), LED_CTL (in), nRST (in), RS (in), RW (in)

### Nets
GND: C26.1 C27.1 C28.1 J2.1(VSS) Q1.E R15.2 R17.1 R23.2 Rp1.5 Rp1.6 Rp1.7 Rp1.8 Rp2.5 Rp2.6 Rp2.7 Rp2.8
VCC5V: C26.2 C27.2 J2.2(VDD) R13.2 R18.1 R19.1 R20.1
DB0: J2.7(DB0) Rp1.1  [project net AD0]
DB1: J2.8(DB1) Rp1.2  [project net AD1]
DB2: J2.9(DB2) Rp1.3  [project net AD2]
DB3: J2.10(DB3) Rp1.4  [project net AD3]
DB4: J2.11(DB4) Rp2.1  [project net AD4]
DB5: J2.12(DB5) Rp2.2  [project net AD5]
DB6: J2.13(DB6) Rp2.3  [project net AD6]
DB7: J2.14(DB7) Rp2.4  [project net AD7]
E: J2.6(E/SCLK) ; port E
LED_CTL: R22.1 R23.1 ; port LED_CTL
LEDA: J2.19(LEDA) R20.2
nRST: C28.2 J2.17(~{RST}) R19.2 ; port nRST
PSB: J2.15(PSB) R17.2 R18.2
RS: J2.4(RS/CS) ; port RS
RW: J2.5(RW/SID) ; port RW
VEE: J2.18(VOUT) R16.2
VO: J2.3(VO) R14.1
NetJ2_20: J2.20(LEDK) R21.2
NetQ1_B: Q1.B R22.2
NetQ1_C: Q1.C R21.1
NetR13_1: R13.1 R14.2 R15.1 R16.1

Not connected (* = marked no-connect by the designer): J2 16(NC)*

### Buses and harness runs
bus DB[7..0] = port DB[7..0]

### Notes on the sheet
- (near R17) Serial
- (near R18) Parallel
- 添加 2K 下拉电阻
- Title
- Size:
- Date:
- A4
- Number:
- Time:
- Revision:
- Sheet
- of
- File:

### Library data of the parts
C26 C27 = CAP_08
C28 = CAP_04: Value: 100nF
J2 = LCM12864: ST7920/LCM12864
Q1 = MMBT3904TT1G
R13-R19 R21-R23 = RES_04
  R13-R19: Value: 4K7
  R21: Value: 1k
  R22 R23: Value: 4k7
R20 = RES_04: Value: 0

## Sheet IS62LV1024.SchDoc
size A4; Organization: Altium Limited; Address1: L3, 12a Rodborough Rd; Address2: Frenchs Forest; Address3: NSW; Address4: Australia 2086
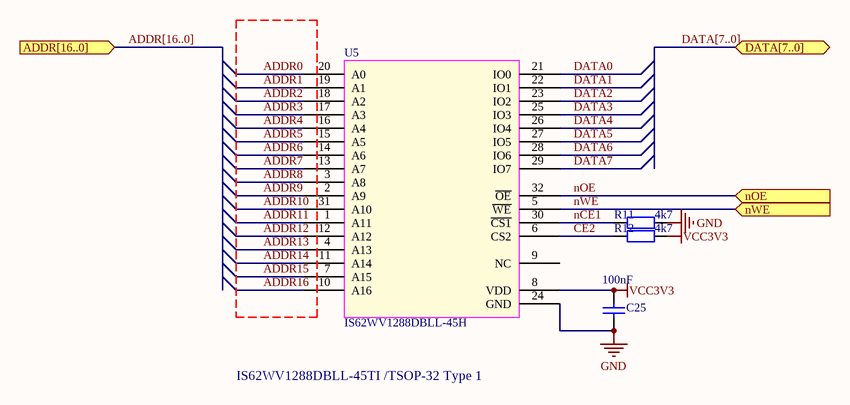
[diagram p6: IS62LV1024.SchDoc]

### Parts
C25  100nF  [R0603]
R11  4k7  [R0603]
R12  4k7  [R0603]
U5  IS62WV1288DBLL-45H  [sTSOP32]

### Ports
ADDR[16..0] (in), DATA[7..0] (bidir), nOE (in), nWE (in)

### Nets
GND: C25.1 R11.2 U5.24(GND)
VCC3V3: C25.2 R12.2 U5.8(VDD)
ADDR0: U5.20(A0)
ADDR1: U5.19(A1)
ADDR2: U5.18(A2)
ADDR3: U5.17(A3)
ADDR4: U5.16(A4)
ADDR5: U5.15(A5)
ADDR6: U5.14(A6)
ADDR7: U5.13(A7)
ADDR8: U5.3(A8)
ADDR9: U5.2(A9)
ADDR10: U5.31(A10)
ADDR11: U5.1(A11)
ADDR12: U5.12(A12)
ADDR13: U5.4(A13)
ADDR14: U5.11(A14)
ADDR15: U5.7(A15)
ADDR16: U5.10(A16)
CE2: R12.1 U5.6(CS2)
DATA0: U5.21(IO0)
DATA1: U5.22(IO1)
DATA2: U5.23(IO2)
DATA3: U5.25(IO3)
DATA4: U5.26(IO4)
DATA5: U5.27(IO5)
DATA6: U5.28(IO6)
DATA7: U5.29(IO7)
nCE1: R11.1 U5.30(~{CS1})
nOE: U5.32(~{OE}) ; port nOE
nWE: U5.5(~{WE}) ; port nWE

Not connected (* = marked no-connect by the designer): U5 9(NC)

### Buses and harness runs
bus ADDR[16..0] = port ADDR[16..0]
bus DATA[7..0] = port DATA[7..0]

### Notes on the sheet
- IS62WV1288DBLL-45TI /TSOP-32 Type 1
- Title
- Size:
- Date:
- A4
- Number:
- Time:
- Revision:
- Sheet
- of
- File:

### Library data of the parts
C25 = CAP_04: Value: 100nF
R11 R12 = RES_04: Value: 4k7
U5 = IS62WV1288DBLL-45TLI/TSOP-32: 128Kx8 LOW VOLTAGE,ULTRA LOW POWER SRAM

## Sheet Readme.SchDoc
size A4
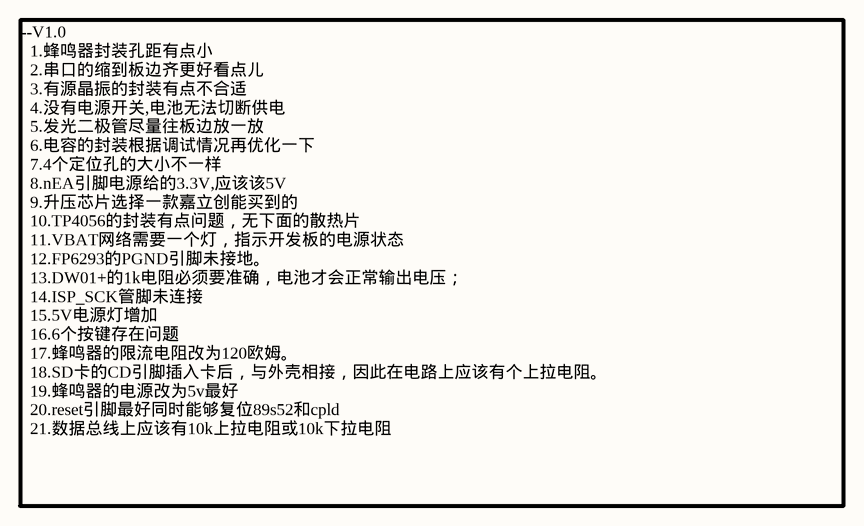
[diagram p7: Readme.SchDoc]

### Notes on the sheet
- --V1.0
  1.蜂鸣器封装孔距有点小
  2.串口的缩到板边齐更好看点儿
  3.有源晶振的封装有点不合适
  4.没有电源开关,电池无法切断供电
  5.发光二极管尽量往板边放一放
  6.电容的封装根据调试情况再优化一下
  7.4个定位孔的大小不一样
  8.nEA引脚电源给的3.3V,应该该5V
  9.升压芯片选择一款嘉立创能买到的
  10.TP4056的封装有点问题，无下面的散热片
  11.VBAT网络需要一个灯，指示开发板的电源状态
  12.FP6293的PGND引脚未接地。
  13.DW01+的1k电阻必须要准确，电池才会正常输出电压；
  14.ISP_SCK管脚未连接
  15.5V电源灯增加
  16.6个按键存在问题
  17.蜂鸣器的限流电阻改为120欧姆。
  18.SD卡的CD引脚插入卡后，与外壳相接，因此在电路上应该有个上拉电阻。
  19.蜂鸣器的电源改为5v最好
  20.reset引脚最好同时能够复位89s52和cpld
  21.数据总线上应该有10k上拉电阻或10k下拉电阻

## Nets that join several sheets
GND: Power (21 pins), AT89S52 (17 pins), EPM1270 (32 pins), Peripheral (9 pins), LCD (16 pins), IS62LV1024 (C25.1 R11.2 U5.24)
VCC3V3: Power (C37.1 U8.2 U8.4), EPM1270 (30 pins), Peripheral (21 pins), IS62LV1024 (C25.2 R12.2 U5.8)
VCC5V: Power (8 pins), AT89S52 (12 pins), Peripheral (R34.1), LCD (7 pins)
~{CS}: EPM1270 (U4.51), Peripheral (R27.1 T1.2)
AD0: AT89S52 (U2.37), LCD (J2.7 Rp1.1)
AD1: AT89S52 (U2.36), LCD (J2.8 Rp1.2)
AD2: AT89S52 (U2.35), LCD (J2.9 Rp1.3)
AD3: AT89S52 (U2.34), LCD (J2.10 Rp1.4)
AD4: AT89S52 (U2.33), LCD (J2.11 Rp2.1)
AD5: AT89S52 (U2.32), LCD (J2.12 Rp2.2)
AD6: AT89S52 (U2.31), LCD (J2.13 Rp2.3)
AD7: AT89S52 (U2.30), LCD (J2.14 Rp2.4)
ADDR0: EPM1270 (U4.131), IS62LV1024 (U5.20)
ADDR1: EPM1270 (U4.132), IS62LV1024 (U5.19)
ADDR2: EPM1270 (U4.133), IS62LV1024 (U5.18)
ADDR3: EPM1270 (U4.134), IS62LV1024 (U5.17)
ADDR4: EPM1270 (U4.118), IS62LV1024 (U5.16)
ADDR5: EPM1270 (U4.117), IS62LV1024 (U5.15)
ADDR6: EPM1270 (U4.114), IS62LV1024 (U5.14)
ADDR7: EPM1270 (U4.113), IS62LV1024 (U5.13)
ADDR8: EPM1270 (U4.105), IS62LV1024 (U5.3)
ADDR9: EPM1270 (U4.104), IS62LV1024 (U5.2)
ADDR10: EPM1270 (U4.121), IS62LV1024 (U5.31)
ADDR11: EPM1270 (U4.103), IS62LV1024 (U5.1)
ADDR12: EPM1270 (U4.112), IS62LV1024 (U5.12)
ADDR13: EPM1270 (U4.106), IS62LV1024 (U5.4)
ADDR14: EPM1270 (U4.111), IS62LV1024 (U5.11)
ADDR15: EPM1270 (U4.108), IS62LV1024 (U5.7)
ADDR16: EPM1270 (U4.110), IS62LV1024 (U5.10)
AX: EPM1270 (U4.75), Peripheral (E1.1 R39.1)
BX: EPM1270 (U4.74), Peripheral (E1.2 R38.1)
CD: EPM1270 (U4.48), Peripheral (R65.1 T1.9)
DATA0: EPM1270 (U4.130), IS62LV1024 (U5.21)
DATA1: EPM1270 (U4.129), IS62LV1024 (U5.22)
DATA2: EPM1270 (U4.127), IS62LV1024 (U5.23)
DATA3: EPM1270 (U4.125), IS62LV1024 (U5.25)
DATA4: EPM1270 (U4.124), IS62LV1024 (U5.26)
DATA5: EPM1270 (U4.123), IS62LV1024 (U5.27)
DATA6: EPM1270 (U4.119), IS62LV1024 (U5.28)
DATA7: EPM1270 (U4.120), IS62LV1024 (U5.29)
DI: EPM1270 (U4.52), Peripheral (R28.1 T1.3)
DO: EPM1270 (U4.49), Peripheral (R30.1 T1.7)
DX: EPM1270 (U4.73), Peripheral (E1.4 R40.1)
KEY_C0: EPM1270 (U4.79), Peripheral (8 pins)
KEY_C1: EPM1270 (U4.80), Peripheral (8 pins)
KEY_L0: EPM1270 (U4.86), Peripheral (5 pins)
KEY_L1: EPM1270 (U4.87), Peripheral (5 pins)
KEY_L2: EPM1270 (U4.76), Peripheral (5 pins)
KEY_L3: EPM1270 (U4.77), Peripheral (5 pins)
LED_CTL: EPM1270 (U4.45), LCD (R22.1 R23.1)
nLED1: EPM1270 (U4.137), Peripheral (HL3.K)
nLED2: EPM1270 (U4.138), Peripheral (HL4.K)
nLED3: EPM1270 (U4.139), Peripheral (HL5.K)
nLED4: EPM1270 (U4.140), Peripheral (HL6.K)
nLED5: EPM1270 (U4.141), Peripheral (HL7.K)
nLED6: EPM1270 (U4.142), Peripheral (HL8.K)
nLED7: EPM1270 (U4.143), Peripheral (HL9.K)
nLED8: EPM1270 (U4.144), Peripheral (HL10.K)
nOE: EPM1270 (U4.122), IS62LV1024 (U5.32)
nWE: EPM1270 (U4.107), IS62LV1024 (U5.5)
PC_RXD: Power (U6.5), AT89S52 (P1.1 P1.12)
PC_TXD: Power (U6.1), AT89S52 (P1.6 P1.7)
PH_SD_CLK: EPM1270 (U4.50), Peripheral (R29.1 T1.5)
PH_SOUND: EPM1270 (U4.98), Peripheral (R36.2 R37.1)
RESET: AT89S52 (6 pins), EPM1270 (Q4.B R50.1)